# EAGLE design KranPowerV1_3 (EAGLE 6.5.0)
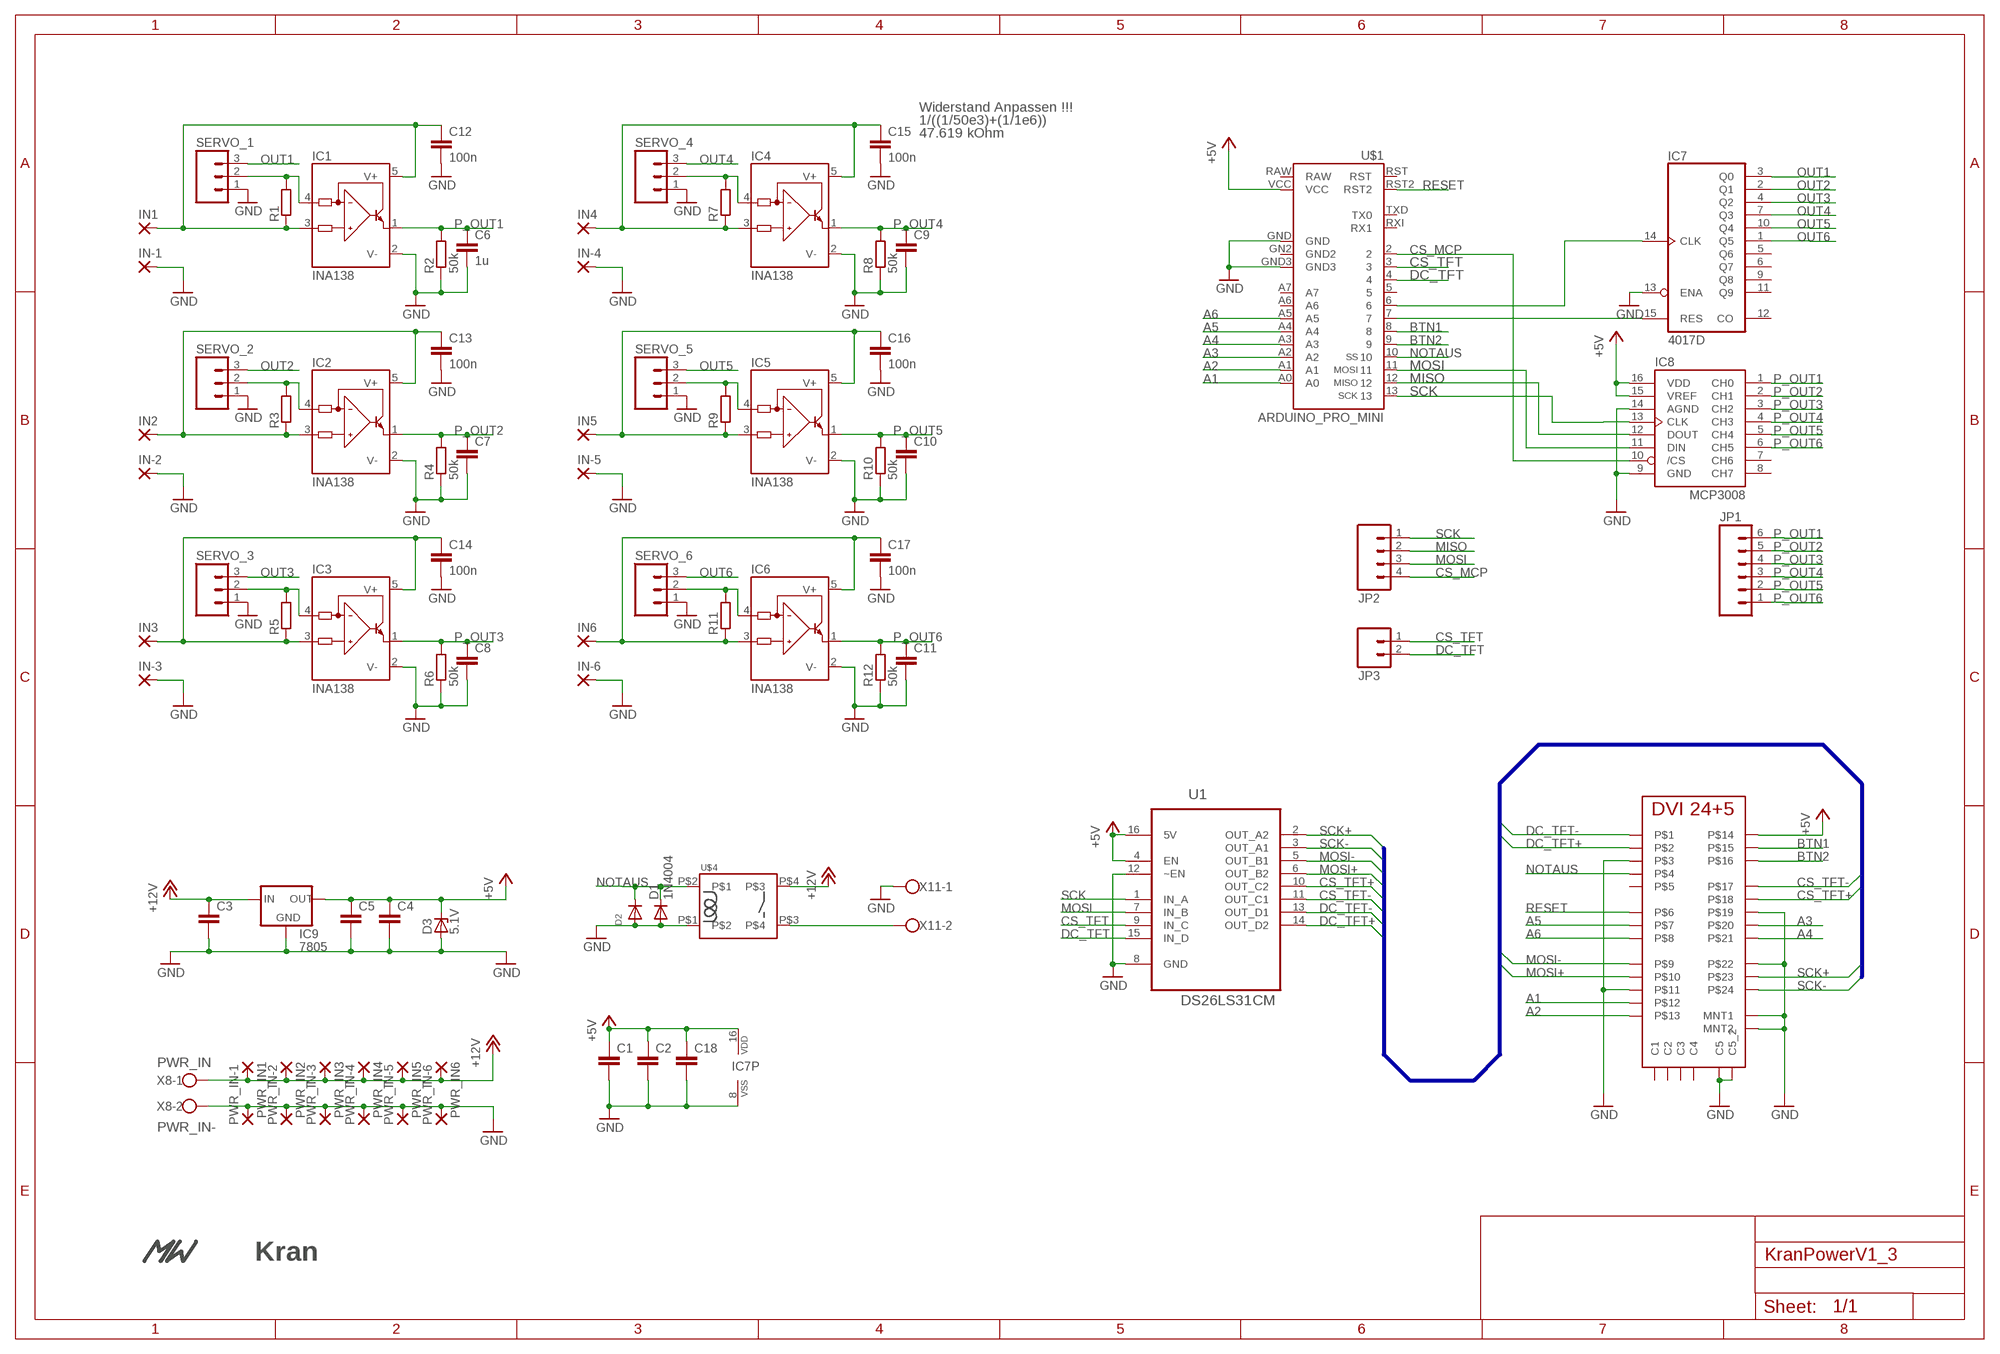
[diagram p0: schematic, sheet 1]

## Parts
C1  C-EUC0603  [C0603]
C2  C-EUC0603  [C0603]
C3  C-EUC0603  [C0603]
C4  C-EUC0603  [C0603]
C5  C-EUC1206  [C1206]
C6  1u  C-EUC0603  [C0603]
C7  C-EUC0603  [C0603]
C8  C-EUC0603  [C0603]
C9  C-EUC0603  [C0603]
C10  C-EUC0603  [C0603]
C11  C-EUC0603  [C0603]
C12  100n  C-EUC0603  [C0603]
C13  100n  C-EUC0603  [C0603]
C14  100n  C-EUC0603  [C0603]
C15  100n  C-EUC0603  [C0603]
C16  100n  C-EUC0603  [C0603]
C17  100n  C-EUC0603  [C0603]
C18  C-EUC0603  [C0603]
D1  1N4004  [DO41-10]
D2  DIODESMA  [SMADIODE]
D3  5.1V  ZENER-DIODEDO34-7  [DO34Z7]
IC1  INA138  [SOT23-5]
IC2  INA138  [SOT23-5]
IC3  INA138  [SOT23-5]
IC4  INA138  [SOT23-5]
IC5  INA138  [SOT23-5]
IC6  INA138  [SOT23-5]
IC7  4017D  [SO16]
IC8  MCP3008  [SO16]
IC9  7805  V_REG_78XXSIDE  [78XXL]
IN1  3,81/1,3  [3,81/1,3]
IN2  3,81/1,3  [3,81/1,3]
IN3  3,81/1,3  [3,81/1,3]
IN4  3,81/1,3  [3,81/1,3]
IN5  3,81/1,3  [3,81/1,3]
IN6  3,81/1,3  [3,81/1,3]
IN-1  3,81/1,3  [3,81/1,3]
IN-2  3,81/1,3  [3,81/1,3]
IN-3  3,81/1,3  [3,81/1,3]
IN-4  3,81/1,3  [3,81/1,3]
IN-5  3,81/1,3  [3,81/1,3]
IN-6  3,81/1,3  [3,81/1,3]
JP1  M06LOCK  [1X06_LOCK]
JP2  M04LOCK  [1X04_LOCK]
JP3  M02LOCK  [1X02_LOCK]
PWR_IN1  3,81/1,3  [3,81/1,3]
PWR_IN2  3,81/1,3  [3,81/1,3]
PWR_IN3  3,81/1,3  [3,81/1,3]
PWR_IN4  3,81/1,3  [3,81/1,3]
PWR_IN5  3,81/1,3  [3,81/1,3]
PWR_IN6  3,81/1,3  [3,81/1,3]
PWR_IN-1  3,81/1,3  [3,81/1,3]
PWR_IN-2  3,81/1,3  [3,81/1,3]
PWR_IN-3  3,81/1,3  [3,81/1,3]
PWR_IN-4  3,81/1,3  [3,81/1,3]
PWR_IN-5  3,81/1,3  [3,81/1,3]
PWR_IN-6  3,81/1,3  [3,81/1,3]
R1  R-EU_R2512  [R2512]
R2  50k  R-EU_R0603  [R0603]
R3  R-EU_R2512  [R2512]
R4  50k  R-EU_R0603  [R0603]
R5  R-EU_R2512  [R2512]
R6  50k  R-EU_R0603  [R0603]
R7  R-EU_R2512  [R2512]
R8  50k  R-EU_R0603  [R0603]
R9  R-EU_R2512  [R2512]
R10  50k  R-EU_R0603  [R0603]
R11  R-EU_R2512  [R2512]
R12  50k  R-EU_R0603  [R0603]
SERVO_1  M03LOCK  [1X03_LOCK]
SERVO_2  M03LOCK  [1X03_LOCK]
SERVO_3  M03LOCK  [1X03_LOCK]
SERVO_4  M03LOCK  [1X03_LOCK]
SERVO_5  M03LOCK  [1X03_LOCK]
SERVO_6  M03LOCK  [1X03_LOCK]
U1  DS26LS31CM  [SOIC127P600X175-16N]
U$1  ARDUINO_PRO_MINI  [ARDUINO_PRO_MINI]
U$2  MW_LOGO  [MW_11X5MM]
U$3  KRAN_LOGO  [KRAN_LOGO]
U$4  RELAY_ZETTLER_AZ767  [RELAY_ZETTLER_AZ767]
U$11  DVI_BUCHSE  [DVI_BUCHSE]
X8  W237-102  [W237-102]
X11  W237-102  [W237-102]

## Nets
+5V: C1.1 C2.1 C4.1 C5.1 C18.1 D3.C IC7.16(VDD) IC8.15(VREF) IC8.16(VDD) IC9.OUT U1.4(EN) U1.16(5V) U$1.VCC U$11.P$14
+12V: C3.1 IC9.IN PWR_IN1.1(P) PWR_IN2.1(P) PWR_IN3.1(P) PWR_IN4.1(P) PWR_IN5.1(P) PWR_IN6.1(P) U$4.P$4 X8.1
A1: U$1.A0 U$11.P$12
A2: U$1.A1 U$11.P$13
A3: U$1.A2 U$11.P$4
A4: U$1.A3 U$11.P$5
A5: U$1.A4 U$11.P$23
A6: U$1.A5 U$11.P$24
BTN1: U$1.8 U$11.P$15
BTN2: U$1.9 U$11.P$16
CS_MCP: IC8.10(/CS) JP2.4 U$1.2
CS_TFT: JP3.1 U1.9(IN_C) U$1.3
CS_TFT+: U1.10(OUT_C2) U$11.P$2
CS_TFT-: U1.11(OUT_C1) U$11.P$1
DC_TFT: JP3.2 U1.15(IN_D) U$1.4
DC_TFT+: U1.14(OUT_D2) U$11.P$18
DC_TFT-: U1.13(OUT_D1) U$11.P$17
GND: C1.2 C2.2 C3.2 C4.2 C5.2 C6.2 C7.2 C8.2 C9.2 C10.2 C11.2 C12.2 C13.2 C14.2 C15.2 C16.2 C17.2 C18.2 D1.A D2.A D3.A IC1.2(V-) IC2.2(V-) IC3.2(V-) IC4.2(V-) IC5.2(V-) IC6.2(V-) IC7.8(VSS) IC7.13(ENA) IC8.9(GND) IC8.14(AGND) IC9.GND IN-1.1(P) IN-2.1(P) IN-3.1(P) IN-4.1(P) IN-5.1(P) IN-6.1(P) PWR_IN-1.1(P) PWR_IN-2.1(P) PWR_IN-3.1(P) PWR_IN-4.1(P) PWR_IN-5.1(P) PWR_IN-6.1(P) R2.1 R4.1 R6.1 R8.1 R10.1 R12.1 SERVO_1.1 SERVO_2.1 SERVO_3.1 SERVO_4.1 SERVO_5.1 SERVO_6.1 U1.8(GND) U1.12(~EN) U$1.GND U$1.GND3 U$4.P$1 U$11.MNT1 U$11.MNT2 U$11.P$3 U$11.P$6 U$11.P$11 U$11.P$19 U$11.P$28(C5) U$11.P$30(C5_2) X8.2 X11.1
MISO: IC8.12(DOUT) JP2.2 U$1.12
MOSI: IC8.11(DIN) JP2.3 U1.7(IN_B) U$1.11
MOSI+: U1.6(OUT_B2) U$11.P$10
MOSI-: U1.5(OUT_B1) U$11.P$9
N$1: C12.1 IC1.3(IN+) IC1.5(V+) IN1.1(P) R1.1
N$2: IC1.4(IN-) R1.2 SERVO_1.2
N$3: C13.1 IC2.3(IN+) IC2.5(V+) IN2.1(P) R3.1
N$4: IC2.4(IN-) R3.2 SERVO_2.2
N$5: C14.1 IC3.3(IN+) IC3.5(V+) IN3.1(P) R5.1
N$6: IC3.4(IN-) R5.2 SERVO_3.2
N$7: C15.1 IC4.3(IN+) IC4.5(V+) IN4.1(P) R7.1
N$8: IC4.4(IN-) R7.2 SERVO_4.2
N$9: C16.1 IC5.3(IN+) IC5.5(V+) IN5.1(P) R9.1
N$10: IC5.4(IN-) R9.2 SERVO_5.2
N$11: C17.1 IC6.3(IN+) IC6.5(V+) IN6.1(P) R11.1
N$12: IC6.4(IN-) R11.2 SERVO_6.2
N$14: IC7.14(CLK) U$1.6
N$15: IC7.15(RES) U$1.7
N$29: U$4.P$3 X11.2
NOTAUS: D1.C D2.C U$1.10 U$4.P$2 U$11.P$20
OUT1: IC7.3(Q0) SERVO_1.3
OUT2: IC7.2(Q1) SERVO_2.3
OUT3: IC7.4(Q2) SERVO_3.3
OUT4: IC7.7(Q3) SERVO_4.3
OUT5: IC7.10(Q4) SERVO_5.3
OUT6: IC7.1(Q5) SERVO_6.3
P_OUT1: C6.1 IC1.1(OUT) IC8.1(CH0) JP1.6 R2.2
P_OUT2: C7.1 IC2.1(OUT) IC8.2(CH1) JP1.5 R4.2
P_OUT3: C8.1 IC3.1(OUT) IC8.3(CH2) JP1.4 R6.2
P_OUT4: C9.1 IC4.1(OUT) IC8.4(CH3) JP1.3 R8.2
P_OUT5: C10.1 IC5.1(OUT) IC8.5(CH4) JP1.2 R10.2
P_OUT6: C11.1 IC6.1(OUT) IC8.6(CH5) JP1.1 R12.2
RESET: U$1.RST2 U$11.P$22
SCK: IC8.13(CLK) JP2.1 U1.1(IN_A) U$1.13
SCK+: U1.2(OUT_A2) U$11.P$7
SCK-: U1.3(OUT_A1) U$11.P$8
Unconnected: IC7.5(Q6) IC7.6(Q7) IC7.9(Q8) IC7.11(Q9) IC7.12(CO) IC8.7(CH6) IC8.8(CH7) U$1.5 U$1.A6 U$1.A7 U$1.GN2(GND2) U$1.RAW U$1.RST U$1.RXI(RX1) U$1.TXD(TX0) U$11.P$21 U$11.P$25(C2) U$11.P$26(C4) U$11.P$27(C3) U$11.P$29(C1)

## Buses
MISO+,MISO-,DC_TFT+,DC_TFT-,MOSI+,MOSI-,CS_TFT+,CS_TFT-,SCK+,SCK-

## Notes on the sheet
- Widerstand Anpassen !!!
- 1/((1/50e3)+(1/1e6))
- 47.619 kOhm
- PWR_IN
- PWR_IN-
- /Users/MatthiasMac/Downloads/kran.bmp

## Library data of the parts
C1-C18 = rcl:C-EU: CAPACITOR, European symbol
D1 = diode:1N4004: DIODE general purpose rectifier, 1 A
D2 = adafruit:DIODE: Diode SMADIODE - SMA Surface Mount Package 20V 1A Schottky Diode Digikey: 641-1014-6-ND DO-1N4148 - Through Hole Small Current Diode SOD-123 20V 1 A (.5mV Vf) Schottky Diode - Digikey: MBRX120TPMSCT-ND SOD-323 10V 570mA (.38mV Vf, 3ns) Schottky Diode - Digikey: ZLLS410CT-ND SOD-523 30V 30mA Schottky Diode (RB751S-40TE61) - Digikey: RB751S-40TE61CT-ND SOT23-R/W - SOT23 Package (R = Solder Paste/Reflow Ovens, W = Hand-Soldering) BAT54Film 40V 300mA - Digikey: 497-7162-1-ND
D3 = diode:ZENER-DIODE: Z-Diode
IC1-IC6 = burr-brown:INA138: High-Side Measurement Current Shunt Monitor; MF: TEXAS INSTRUMENTS; MPN: INA138NA/250; OC_FARNELL: 1564888; OC_NEWARK: 80K5906
IC7 = 40xx:4017: COUNTER/DIVIDER
IC8 = adafruit:MCP3008
IC9 = SparkFun:V_REG_78XX: Voltage Regulator Standard 7805 5V regulator. IGO (Input Ground Output). Spark Fun Electronics SKU : COM-00107
IN1-IN6 IN-1-IN-6 PWR_IN1-PWR_IN6 PWR_IN-1-PWR_IN-6 = wirepad:3,81/1,3: THROUGH-HOLE PAD
JP1 = SparkFun:M06: Header 6 Standard 6-pin 0.1" header. Use with straight break away headers (SKU : PRT-00116), right angle break away headers (PRT-00553), swiss pins (PRT-00743), machine pins (PRT-00117), and female headers (PRT-00115). Molex polarized connector foot print use with SKU : PRT-08094 with associated crimp pins and housings. NOTES ON THE VARIANTS LOCK and LOCK_LONGPADS... This footprint was designed to help hold the alignment of a through-hole component (i.e. 6-pin header) while soldering it into place. You may notice that each hole has been shifted either up or down by 0.005 of an inch from it's more standard position (which is a perfectly straight line). This slight alteration caused the pins (the squares in the middle) to touch the edges of the holes. Because they are alternating, it causes a "brace" to hold the component in place. 0.005 has proven to be the perfect amount of "off-center" position when using our standard breakaway headers. Although looks a little odd when you look at the bare footprint, once you have a header in there, the alteration is very hard to notice. Also, if you push a header all the way into place, it is covered up entirely on the bottom side. This idea of altering the position of holes to aid alignment will be further integrated into the Sparkfun Library for other footprints. It can help hold any component with 3 or more connection pins.
JP2 = SparkFun:M04: Header 4 Standard 4-pin 0.1" header. Use with straight break away headers (SKU : PRT-00116), right angle break away headers (PRT-00553), swiss pins (PRT-00743), machine pins (PRT-00117), and female headers (PRT-00115). Molex polarized connector foot print use with SKU : PRT-08231 with associated crimp pins and housings. 1MM SMD Version SKU: PRT-10208
JP3 = SparkFun:M02: Header 2 Standard 2-pin 0.1" header. Use with straight break away headers (SKU : PRT-00116), right angle break away headers (PRT-00553), swiss pins (PRT-00743), machine pins (PRT-00117), and female headers (PRT-00115). Molex polarized connector foot print use with SKU : PRT-08233 with associated crimp pins and housings.
R1-R12 = rcl:R-EU_: RESISTOR, European symbol
SERVO_1-SERVO_6 = SparkFun:M03: Header 3 Standard 3-pin 0.1" header. Use with straight break away headers (SKU : PRT-00116), right angle break away headers (PRT-00553), swiss pins (PRT-00743), machine pins (PRT-00117), and female headers (PRT-00115). Molex polarized connector foot print use with SKU : PRT-08232 with associated crimp pins and housings.
U1 = Matthias:DS26LS31CM: Line Driver; MPN: DS26LS31CM; OC_FARNELL: 9487859; OC_NEWARK: 07B5236; PACKAGE: SOIC-16; SUPPLIER: NationalSemiconductor
U$1 = SparkFun:ARDUINO_PRO_MINI
U$2 = MWlogo:MW_LOGO
U$3 = MWlogo:KRAN_LOGO
U$4 = SparkFun:RELAY_ZETTLER_AZ767: http://www.conrad.de/ce/de/product/503633/Subminiatur-Leistungs-Relais-AZ767-10-A-Zettler-Electronics-AZ767-1A-6DE-6-VDC-1-Schliesser-Max-DC-5-AAC-10-A-Max?queryFromSuggest=true
U$11 = Matthias:DVI_BUCHSE
X8 X11 = con-wago-500:W237-102: WAGO SCREW CLAMP; MPN: 237-102; OC_FARNELL: unknown; OC_NEWARK: 70K9898

## Board
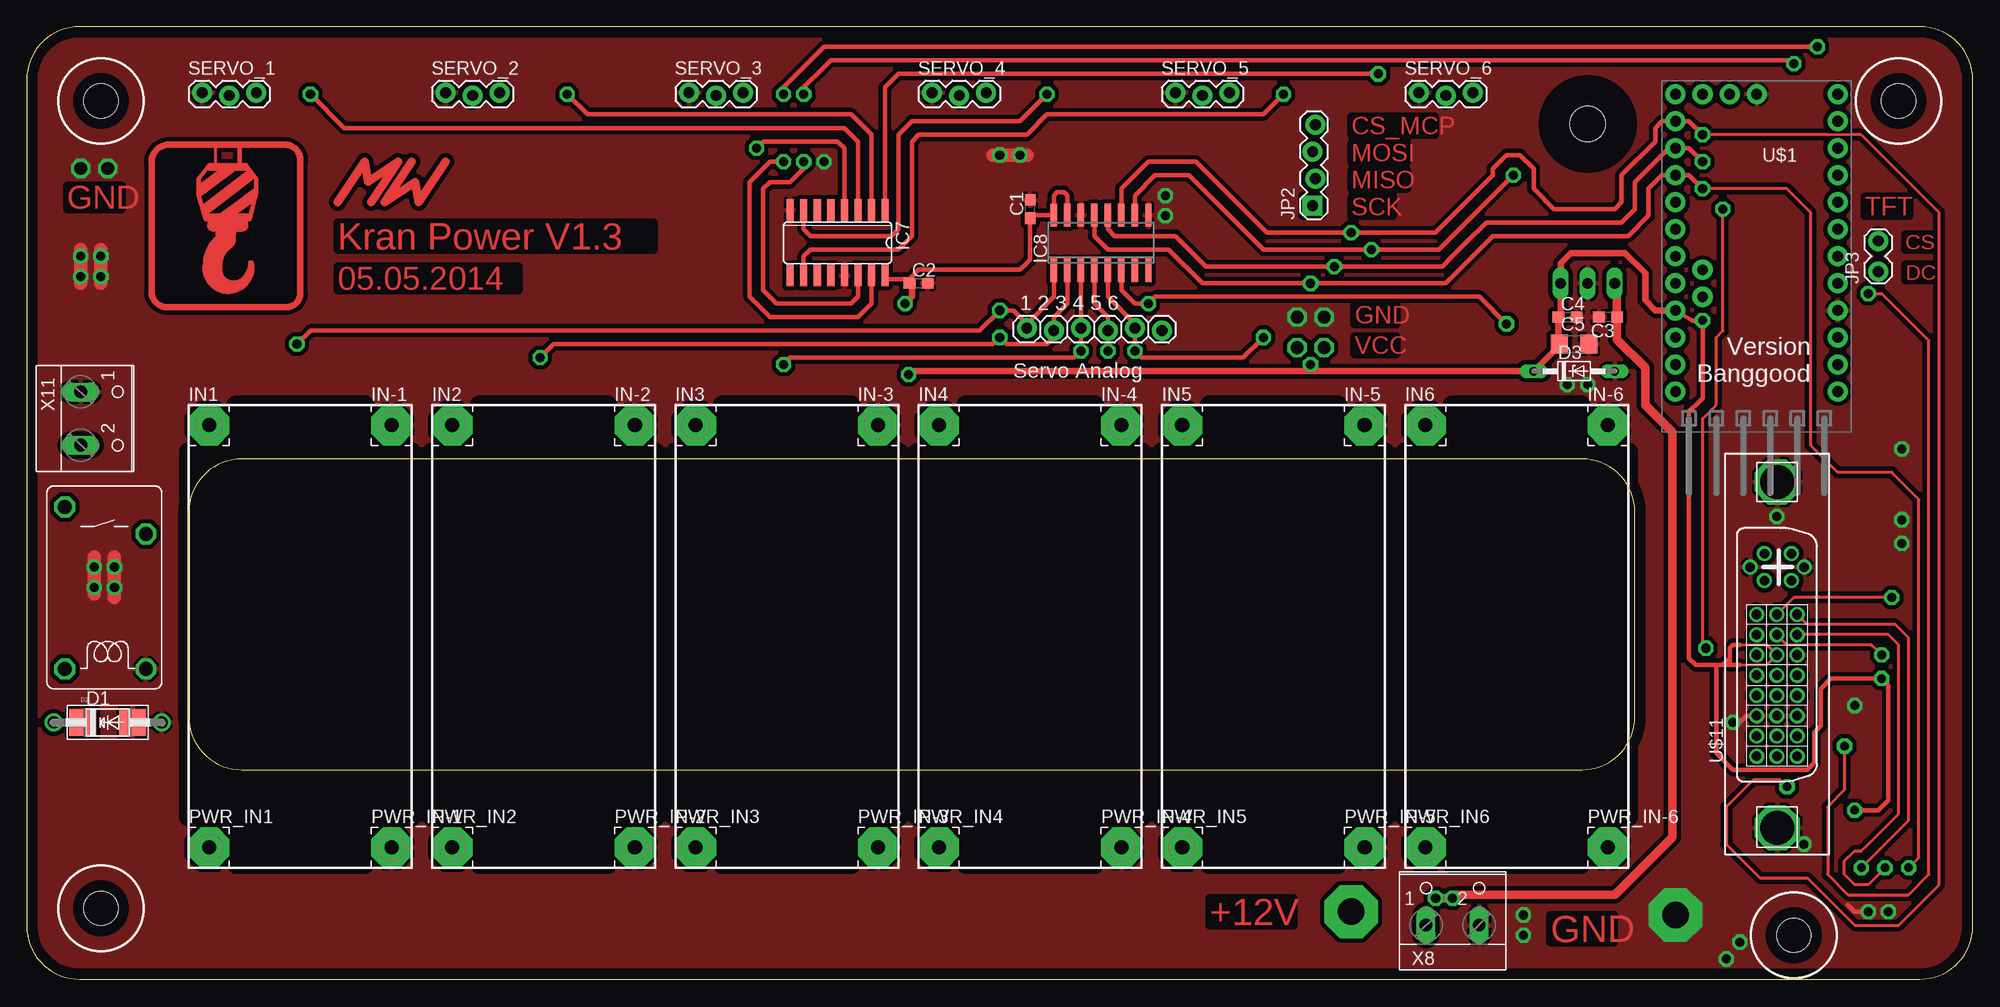
[diagram p1: board, top side]
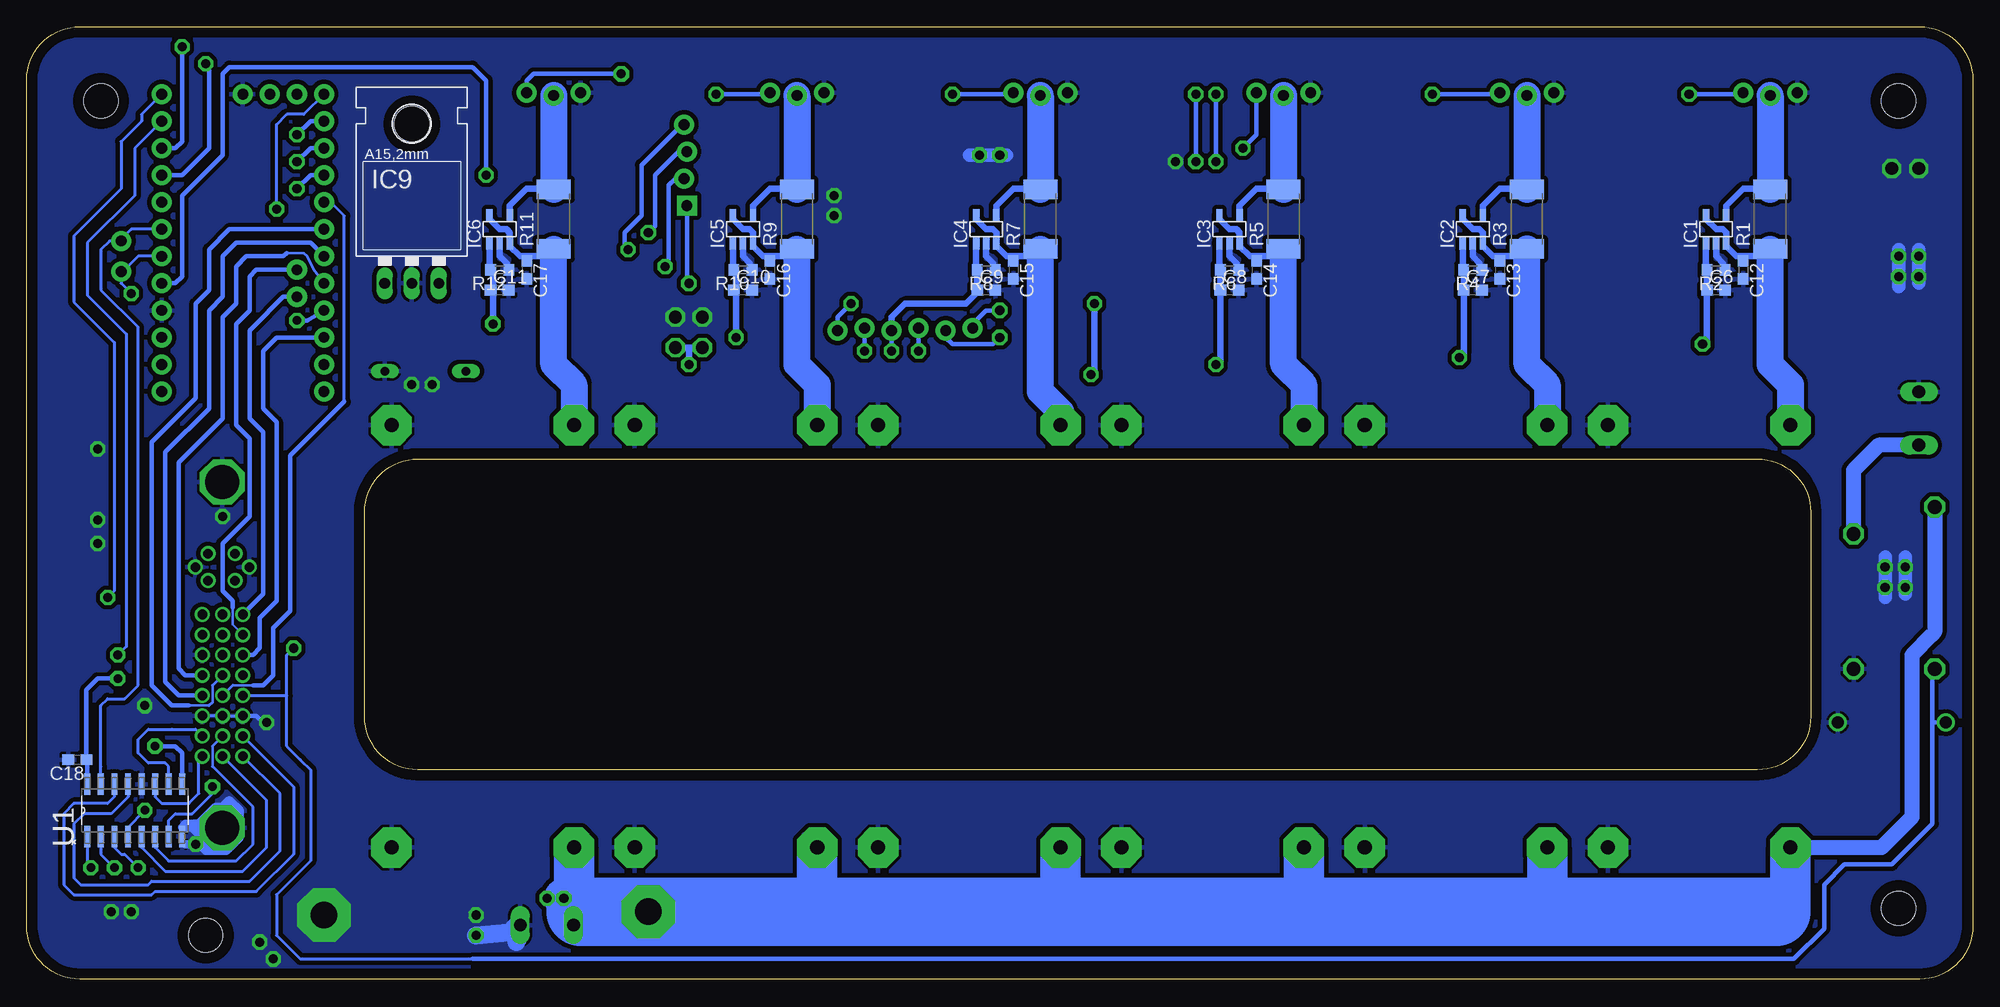
[diagram p2: board, bottom side, seen from below]

Size 182.88 x 89.53 mm. Coordinates in mm from the lower left corner, seen from the top.
Outline: 0,84.53 0,5 arc90 5,0 177.88,0 arc90 182.88,5 182.88,84.53 arc90 177.88,89.53 5,89.53 arc90 0,84.53
Outline: 15.24,43.89 15.24,24.68 arc90 20.24,19.68 146.13,19.68 arc90 151.13,24.68 151.13,43.89 arc90 146.13,48.89 20.24,48.89 arc90 15.24,43.89
Copper layers (1*16): Top 0.035mm / dielectric 1.5mm / Bottom 0.035mm
Design rules "default": minimum track width 10mil, minimum drill 24mil, track to track 8mil, track to pad 8mil, pad to pad 8mil, via to via 8mil, smd to smd 8mil, copper to edge 40mil, drill to drill 8mil, minimum pad ring 10mil, minimum via ring 8mil, stop-mask expansion 4mil, vias tented up to drill 0mil, thermal gap 10mil
Holes 3.2 mm at 6.98,6.67 6.98,82.55 175.9,82.55 166.05,4.13
tRestrict: area 15.2,10.8 to 36.2,54; area 38.1,10.8 to 59.1,54; area 61,10.8 to 81.9,54; area 83.8,10.8 to 104.8,54; area 106.7,10.8 to 127.6,54; area 129.5,10.8 to 150.5,54
bRestrict: area 15.2,19.7 to 151.1,48.9

### Footprints (pad centres in the part's own frame; a part is rotated, then mirrored left to right if it is on the bottom)
C0603 = smd 1.1 x 1: 1 -0.85,0; 2 0.85,0
C1206 = smd 1.6 x 1.8: 1 -1.4,0; 2 1.4,0
DO41-10 = drill 1.118: A 5.08,0; C -5.08,0
SMADIODE = smd 2.54 x 2.54: A 2.349,0; C -2.349,0
DO34Z7 = drill 0.813 long: A 3.81,0; C -3.81,0
SOT23-5 = smd 0.6 x 1.2: 1 -0.95,-1.306; 2 0,-1.306; 3 0.95,-1.306; 4 0.95,1.306; 5 -0.95,1.306
SO16 = smd 0.66 x 2.032: 1 -4.445,-3.073; 2 -3.175,-3.073; 3 -1.905,-3.073; 4 -0.635,-3.073; 5 0.635,-3.073; 6 1.905,-3.073; 7 3.175,-3.073; 8 4.445,-3.073; 9 4.445,3.073; 10 3.175,3.073; 11 1.905,3.073; 12 0.635,3.073; 13 -0.635,3.073; 14 -1.905,3.073; 15 -3.175,3.073; 16 -4.445,3.073
SO16' = smd 0.6 x 2.2: 1 -4.445,-2.6; 2 -3.175,-2.6; 3 -1.905,-2.6; 4 -0.635,-2.6; 5 0.635,-2.6; 6 1.905,-2.6; 7 3.175,-2.6; 8 4.445,-2.6; 9 4.445,2.6; 10 3.175,2.6; 11 1.905,2.6; 12 0.635,2.6; 13 -0.635,2.6; 14 -1.905,2.6; 15 -3.175,2.6; 16 -4.445,2.6
78XXL = drill 1.016 long: GND 0,-3.81; IN -2.54,-3.81; OUT 2.54,-3.81 | hole 3.302: 0,11.176
3,81/1,3 = drill 1.321 pad 3.81 octagon: 1 0,0
1X06_LOCK = drill 1.016 pad 1.88: 1 0,0; 2 2.54,-0.254; 3 5.08,0; 4 7.62,-0.254; 5 10.16,0; 6 12.7,-0.254
1X04_LOCK = drill 1.016 pad 1.88 square: 1 0,0.127 | drill 1.016 pad 1.88: 2 2.54,-0.127; 3 5.08,0.127; 4 7.62,-0.127
1X02_LOCK = drill 1.016 pad 1.88: 1 -0.178,0; 2 2.718,0
R2512 = smd 1.8 x 3.2: 1 -2.8,0; 2 2.8,0
R0603 = smd 1 x 1.1: 1 -0.85,0; 2 0.85,0
1X03_LOCK = drill 1.016 pad 1.88: 1 0,0.127; 2 2.54,-0.127; 3 5.08,0.127
SOIC127P600X175-16N = smd 1.981 x 0.559: 1 -2.464,4.445; 2 -2.464,3.175; 3 -2.464,1.905; 4 -2.464,0.635; 5 -2.464,-0.635; 6 -2.464,-1.905; 7 -2.464,-3.175; 8 -2.464,-4.445; 9 2.464,-4.445; 10 2.464,-3.175; 11 2.464,-1.905; 12 2.464,-0.635; 13 2.464,0.635; 14 2.464,1.905; 15 2.464,3.175; 16 2.464,4.445
ARDUINO_PRO_MINI = drill 1.016 pad 1.88: 2 -7.62,2.54; 3 -7.62,0; 4 -7.62,-2.54; 5 -7.62,-5.08; 6 -7.62,-7.62; 7 -7.62,-10.16; 8 -7.62,-12.7; 9 -7.62,-15.24; 10 7.62,-15.24; 11 7.62,-12.7; 12 7.62,-10.16; 13 7.62,-7.62; A0 7.62,-5.08; A1 7.62,-2.54; A2 7.62,0; A3 7.62,2.54; A4 5.08,1.27; A5 5.08,3.81; A6 2.54,-15.24; A7 5.08,-15.24; GN2 7.62,10.16; GND -7.62,5.08; GND3 0,-15.24; RAW 7.62,12.7; RST -7.62,7.62; RST2 7.62,7.62; RXI -7.62,10.16; TXD -7.62,12.7; VCC 7.62,5.08
RELAY_ZETTLER_AZ767 = drill 1.3 octagon: P$1 1.85,1.49; P$2 1.85,9.11; P$3 14.55,1.49; P$4 17.09,9.11
DVI_BUCHSE = drill 3.2 octagon: MNT1 -6.71,1.878; MNT2 25.79,1.878 | drill 0.9: P$1 -0.003,-0.006; P$2 1.902,-0.006; P$3 3.807,-0.006; P$4 5.712,-0.006; P$5 7.617,-0.006; P$6 9.522,-0.006; P$7 11.427,-0.006; P$8 13.332,-0.006; P$9 -0.003,1.899; P$10 1.902,1.899; P$11 3.807,1.899; P$12 5.712,1.899; P$13 7.617,1.899; P$14 9.522,1.899; P$15 11.427,1.899; P$16 13.332,1.899; P$17 -0.003,3.804; P$18 1.902,3.804; P$19 3.807,3.804; P$20 5.712,3.804; P$21 7.617,3.804; P$22 9.522,3.804; P$23 11.427,3.804; P$24 13.332,3.804; P$25 19.047,3.07; P$26 19.047,0.53; P$27 16.507,0.53; P$28 17.777,-0.661; P$29 16.507,3.07; P$30 17.777,4.42
W237-102 = drill 1.194 long: 1 -2.5,-1.27; 2 2.5,-1.27

### Placement (x,y rotation side)
C1  94.3,72.39 90 top
C2  83.82,65.41 0 top
C3  148.59,62.23 180 top
C4  144.78,62.23 0 top
C5  145.42,59.69 0 top
C6  24.13,64.77 0 bottom
C7  46.99,64.77 0 bottom
C8  69.85,64.77 0 bottom
C9  92.71,64.77 0 bottom
C10  115.57,64.77 0 bottom
C11  138.43,64.77 0 bottom
C12  21.59,66.67 270 bottom
C13  44.45,66.67 270 bottom
C14  67.31,66.67 270 bottom
C15  90.17,66.67 270 bottom
C16  113.03,66.67 270 bottom
C17  135.89,66.67 270 bottom
C18  178.12,20.64 180 bottom
D1  7.62,24.13 0 top
D2  7.62,24.13 0 top
D3  145.42,57.15 0 top
IC1  24.13,70.48 0 bottom
IC2  46.99,70.48 0 bottom
IC3  69.85,70.48 0 bottom
IC4  92.71,70.48 0 bottom
IC5  115.57,70.48 0 bottom
IC6  138.43,70.48 0 bottom
IC7  76.2,69.22 180 top
IC8  MCP3008  [SO16']  100.96,69.22 0 top
IC9  146.69,69.22 0 bottom
IN1  17.14,52.07 0 top
IN2  40.01,52.07 0 top
IN3  62.87,52.07 0 top
IN4  85.72,52.07 0 top
IN5  108.58,52.07 0 top
IN6  131.44,52.07 0 top
IN-1  34.29,52.07 0 top
IN-2  57.15,52.07 0 top
IN-3  80.01,52.07 0 top
IN-4  102.87,52.07 0 top
IN-5  125.73,52.07 0 top
IN-6  148.59,52.07 0 top
JP1  106.68,60.96 180 top
JP2  120.97,72.71 90 top
JP3  173.99,66.67 90 top
PWR_IN1  17.14,12.38 0 top
PWR_IN2  40.01,12.38 0 top
PWR_IN3  62.87,12.38 0 top
PWR_IN4  85.72,12.38 0 top
PWR_IN5  108.58,12.38 0 top
PWR_IN6  131.44,12.38 0 top
PWR_IN-1  34.29,12.38 0 top
PWR_IN-2  57.15,12.38 0 top
PWR_IN-3  80.01,12.38 0 top
PWR_IN-4  102.87,12.38 0 top
PWR_IN-5  125.73,12.38 0 top
PWR_IN-6  148.59,12.38 0 top
R1  19.05,71.44 90 bottom
R2  24.13,66.67 180 bottom
R3  41.91,71.44 90 bottom
R4  46.99,66.67 180 bottom
R5  64.77,71.44 90 bottom
R6  69.85,66.67 180 bottom
R7  87.63,71.44 90 bottom
R8  92.71,66.67 180 bottom
R9  110.49,71.44 90 bottom
R10  115.57,66.67 180 bottom
R11  133.35,71.44 90 bottom
R12  138.43,66.67 180 bottom
SERVO_1  16.51,83.19 0 top
SERVO_2  39.37,83.19 0 top
SERVO_3  62.23,83.19 0 top
SERVO_4  85.09,83.19 0 top
SERVO_5  107.95,83.19 0 top
SERVO_6  130.81,83.19 0 top
U1  172.72,15.88 90 bottom
U$1  162.56,67.94 180 top
U$2  29.21,73.03 0 top
U$3  11.43,62.86 0 top
U$4  12.7,27.3 90 top
U$11  166.37,20.95 90 top
X8  133.99,6.35 0 top
X11  6.35,52.7 270 top

### Tracks (layer width: path | path; a pad name or v marks a point on that pad's centre or on a via)
+5V  (via drill 0.8 pad 1.42, 0.85 pad 1.42, 1.2)
  Top 0.254: 163.51,31.43 160.97,31.43 | 160.97,29.53 163.51,29.53
  Top 0.305: U$11.P$14 | U$11.P$14 163.83,31.11 | 163.83,31.11 163.51,31.43 | 163.51,29.53 U$11.P$14 | U$11.P$14 163.83,31.11
  Top 0.406: C2.1 82.97,65.83 | 82.97,65.83 83.82,66.67 93.34,66.67 93.98,67.31 94.19,67.53 94.3,67.63 C1.1 94.57,71.81 IC8.16 96.52,73.66 96.84,73.98 97.47,73.98 97.79,73.66 97.79,72.07 IC8.15 | 82.97,65.83 80.96,65.83 IC7.16 | 82.55,57.15 83.18,57.15 82.87,57.15 v82.87,56.83 | 160.97,29.53 160.34,29.53 160.02,29.53 | 160.02,29.53 159.39,29.53 | 159.39,29.53 158.75,29.53 | 156.53,61.91 U$1.VCC 156.53,61.91 | 156.53,61.91 v157.48,61.91 157.48,54.61 | v171.77,15.88 173.99,15.88 174.94,16.83 174.94,27.62 v174.31,28.26 169.55,28.26 168.59,27.3 168.59,23.81 167.96,23.18 167.96,20.32 167.32,19.68 160.34,19.68 158.75,21.27 158.75,29.21 158.75,29.53 | 157.16,54.29 156.21,53.34 156.21,30.16 156.84,29.53 158.75,29.53 | 157.16,54.29 157.48,54.61 | 157.48,54.61 157.16,54.29 | 160.97,31.43 160.34,31.43 160.02,31.11 160.02,30.16 | 160.02,30.16 159.39,29.53 | 159.39,29.53 160.02,30.16 | 160.02,30.16 160.02,29.53
  Top 0.61: v82.55,63.5 83.18,64.14 83.18,65.19 C2.1 | 83.18,57.15 120.65,57.15 | 120.65,57.15 D3.C 143.51,59.05 144.02,59.56 C5.1 143.93,59.77 C4.1 144.15,62.23 IC9.OUT 144.15,67.31 145.1,68.26 150.18,68.26 152.08,66.36 152.08,63.82 153.03,62.86 U$1.VCC | v120.65,57.78 120.65,57.15
  Bottom 0.305: U1.4 173.36,14.29 v171.77,15.88
  Bottom 0.406: U1.16 177.17,20.54 C18.1 177.27,27.2 176.21,28.26 v174.31,28.26 | v157.48,61.91 156.53,61.91 U$1.VCC
  Bottom 0.61: v82.87,56.83 82.55,57.15 82.55,59.05 v82.55,63.5 | 120.65,59.37 v121.92,59.37 120.65,59.37 | 120.65,59.37 v119.38,59.37 | 120.65,59.37 v120.65,57.78
+12V  (via drill 0.85 pad 1.42, 2.5 pad 5)
  Top 0.813: IC9.IN 149.44,65.19 C3.1 149.44,60.11 152.08,57.47 152.08,53.98 154.62,51.44 154.62,13.34 150.18,8.89 149.23,7.94 134.3,7.94 v133.99,7.62 v132.4,7.62
  Bottom 0.406: 131.44,6.35 131.49,6.35 X8.1
  Bottom 0.813: v132.4,7.62 v133.99,7.62
  Bottom 1.422: PWR_IN1.1 8.57,12.38 5.71,15.24 5.71,30.48 3.81,32.38 3.59,32.61 U$4.P$4
  Bottom 3.81: v132.4,7.62 132.08,7.58 131.49,6.98 131.49,7.58 129.54,6.35 129.54,5.71 | PWR_IN6.1 131.44,6.35 130.81,6.35 | PWR_IN5.1 108.58,6.35 | PWR_IN4.1 85.72,6.35 86.36,6.35 | PWR_IN3.1 62.87,6.35 62.23,6.35 | PWR_IN2.1 40.01,6.35 40.64,6.35 | 18.45,6.35 17.14,6.39 PWR_IN1.1
  Bottom 6.452: 129.54,6.35 130.81,6.35 | 130.81,6.35 130.18,6.35 129.54,6.35 | 129.54,6.35 130.81,6.35 | 130.81,6.35 129.54,6.35 | 129.54,6.35 v124.46,6.35 108.58,6.35 86.36,6.35 62.23,6.35 40.64,6.35 18.45,6.35
A1
  Bottom 0.254: 163.51,27.62 161.61,27.62
  Bottom 0.305: U$11.P$12 163.51,27.62 | 153.03,54.29 153.03,71.75 154.31,73.03 U$1.A0
  Bottom 0.406: 153.03,54.29 154.31,53.02 158.12,49.21 158.12,34.61 159.7,33.02 159.7,28.57 160.66,27.62 161.61,27.62
A2
  Bottom 0.254: 165.42,27.62 165.42,26.04 | 165.74,25.72 167.32,25.72 167.64,25.72
  Bottom 0.305: 165.74,25.72 165.42,26.04 | 165.42,27.62 U$11.P$13
  Bottom 0.406: U$1.A1 163.83,70.48 165.74,68.58 165.74,64.77 167,63.5 167,54.61 171.13,50.48 171.13,27.62 169.23,25.72 167.64,25.72
A3
  Bottom 0.406: 165.74,54.61 165.74,53.66 | 165.74,53.66 165.74,53.98 | 165.74,53.98 165.74,53.66 | 165.74,53.66 165.74,53.98 | 165.74,53.98 165.74,54.61 | 165.74,54.61 165.74,62.86 164.47,64.14 164.47,67.94 163.2,69.22 156.21,69.22 U$1.A2 | 165.74,53.66 169.86,49.53 169.86,27.94 168.59,26.67 U$11.P$4
A4
  Bottom 0.254: U$1.A3 155.89,66.67 156.53,67.94 156.84,68.26 157.16,68.26 158.43,68.26
  Bottom 0.406: U$11.P$5 167.96,28.57 168.59,29.21 168.59,48.58 164.47,52.7 164.47,62.23 163.2,63.5 163.2,66.99 162.24,67.94 158.75,67.94 158.43,68.26
A5
  Bottom 0.254: 163.51,34.92 163.51,33.33 U$11.P$23
  Bottom 0.406: U$1.A4 157.8,66.67 161.29,66.67 161.93,66.04 161.93,62.86 163.2,61.59 163.2,52.07 161.93,50.8 161.93,43.5 164.47,40.96 164.47,36.51 163.51,35.56 163.51,34.92
A6
  Bottom 0.406: U$1.A5 158.75,64.14 161.61,61.28 161.93,60.96 161.93,52.7 160.66,51.44 160.66,36.2 U$11.P$24
BTN1  (via drill 0.85 pad 1.42)
  Top 0.254: 167.32,31.43 165.42,31.43
  Top 0.305: v174.31,30.48 173.67,31.11 173.36,31.43 167.32,31.43 | 165.42,31.43 165.42,31.44 U$11.P$15
  Bottom 0.305: U$1.8 172.72,78.11 172.72,73.66 177.17,69.22 177.17,64.29 173.51,60.64 173.51,31.27 v174.31,30.48
BTN2  (via drill 0.85 pad 1.42)
  Top 0.305: v175.26,35.88 166.05,35.88 U$11.P$16
  Bottom 0.305: U$1.9 172.09,81.28 172.09,80.64 173.99,78.74 173.99,74.3 178.44,69.85 178.44,63.66 174.62,59.85 174.62,36.51 v175.26,35.88
CS_MCP  (via drill 0.85 pad 1.42)
  Top 0.406: v139.7,75.56 132.72,68.58 127,68.58 | IC8.10 104.14,73.66 106.05,75.56 109.22,75.56 113.66,71.12 116.2,68.58 v126.36,68.58 | IC8.10 104.14,71.75 IC8.10 | 127,68.58 v126.36,68.58 | v126.36,68.58 127,68.58
  Bottom 0.406: U$1.2 168.91,65.41 168.28,66.04 168.28,73.66 164.47,77.47 164.47,85.09 163.83,85.72 140.97,85.72 139.7,84.45 139.7,79.38 v139.7,75.56 | JP2.4 121.28,80.33 125.09,76.52 125.09,71.75 126.68,70.17 126.68,68.58 v126.36,68.58
CS_TFT  (via drill 0.8 pad 1.42, 0.85 pad 1.42)
  Top 0.305: v170.81,21.91 170.81,17.78 169.23,16.19 169.23,9.84 171.13,7.94 176.85,7.94 178.75,9.84 178.75,60.01 174.31,64.45 v173.04,64.45
  Bottom 0.305: U$1.3 172.4,67.94 173.99,66.36 | 173.99,66.36 JP3.1 | 173.99,66.36 173.99,65.41 v173.04,64.45
  Bottom 0.406: U1.9 168.28,21.27 168.91,21.91 v170.81,21.91
CS_TFT+
  Bottom 0.305: U$11.P$2 167.01,23.49 169.23,23.49 171.45,23.49 172.4,22.54 172.4,21.27 171.45,20.32 169.86,20.32 169.55,20 U1.10
CS_TFT-
  Bottom 0.305: U1.11 170.81,17.14 170.18,16.51 167.64,16.51 166.69,17.46 166.69,20.63 U$11.P$1
DC_TFT
  Bottom 0.305: U1.15 175.9,20 175.9,25.72 175.26,26.35 173.67,26.35 173.36,26.67 172.4,27.62 172.4,61.28 175.9,64.77 175.9,68.58 175.08,69.39 JP3.2 173.99,69.53 173.04,70.48 U$1.4
DC_TFT+
  Bottom 0.305: U1.14 174.62,17.14 175.26,16.51 178.44,16.51 179.39,15.56 179.39,8.89 178.44,7.94 171.13,7.94 170.81,8.26 161.29,8.26 157.8,11.75 157.8,18.1 162.56,22.86 U$11.P$18
DC_TFT-
  Bottom 0.305: U1.13 173.36,17.14 174.94,15.56 177.48,15.56 178.44,14.6 178.44,9.52 177.8,8.89 171.45,8.89 171.13,9.21 161.93,9.21 159.07,12.06 159.07,17.45 U$11.P$17
GND  (via drill 0.85 pad 1.42, 1.2, 2.5 pad 5)
  Top 0.406: v160.34,24.13 160.97,24.13 161.61,24.77 U$11.P$19 | 172.72,6.35 171.77,6.35 171.13,6.98
  Top 1.27: v6.98,66.04 6.98,68.58 6.98,65.41 | v5.08,66.04 5.08,65.41 v5.08,66.04 | v5.08,66.04 5.08,68.58 | v8.25,36.83 8.25,39.69 8.25,35.88 | v6.35,36.83 6.35,36.2 v6.35,36.83 | v6.35,36.83 6.35,39.69 | v93.34,77.47 90.8,77.47 93.98,77.47
  Bottom 0.305: 161.29,24.77 161.29,24.76 U$11.P$19 U$11.P$11 U$11.P$3
  Bottom 0.406: U1.8 168.28,13.02 167.96,12.7 | v160.34,24.13 160.66,24.13 161.29,24.77 U$11.P$19
  Bottom 0.61: IC1.2 24.13,67.94 23.5,67.31 23.5,66.89 R2.1 | IC2.2 46.99,67.94 46.35,67.31 46.35,66.89 R4.1 | IC3.2 69.85,67.94 69.22,67.31 69.22,66.89 R6.1 | IC4.2 92.71,67.94 92.07,67.31 92.07,66.89 R8.1 | IC5.2 115.57,67.94 114.93,67.31 114.93,66.89 R10.1 | IC6.2 138.43,67.94 137.8,67.31 137.8,66.89 R12.1
  Bottom 0.813: 167.96,12.7 v167,12.7 | v167,12.7 166.69,12.7 166.05,12.06 164.15,12.06 162.88,13.34 162.88,15.88 163.83,16.83 164.15,16.51 164.47,16.19 165.1,16.19 166.69,14.6 167.96,14.6 168.28,14.29 167.32,14.29 165.74,12.7 v167,12.7
  Bottom 1.27: v6.98,66.04 6.98,65.09 v6.98,66.04 | v6.98,66.04 6.98,68.58 | v5.08,66.04 5.08,65.41 5.08,68.58 | v8.25,36.83 8.25,35.88 v8.25,36.83 | v8.25,36.83 8.25,39.69 | v6.35,36.83 6.35,36.2 6.35,39.69 | v93.34,77.47 94.3,77.47 v93.34,77.47 | v93.34,77.47 90.8,77.47
  Bottom 1.676: v140.65,4.13 137.16,4.45 137.16,4.76 136.53,5.4 136.84,3.49
  other vias: 107,71.75 107,73.66 74.93,76.84 144.78,55.88 146.69,55.88 5.08,76.2 7.62,76.2 121.92,62.23 119.38,62.23 140.65,6.03 5.08,67.94 6.98,67.94 154.94,6.03 164.47,43.5 176.21,43.18 171.77,25.72 176.21,49.85 159.7,1.91 160.97,3.49 174.94,6.35 176.21,40.96 6.35,38.73 8.25,38.73 91.44,77.47 173.04,6.35
  pour Bottom (isolate 0.406): 0,84.53 0,5 arc90 5,0 177.88,0 arc90 182.88,5 182.88,84.53 arc90 177.88,89.53 5,89.53 arc90
  pour Top (isolate 0.406): 0,84.53 0,5 arc90 5,0 177.88,0 arc90 182.88,5 182.88,84.53 arc90 177.88,89.53 5,89.53 arc90
MISO  (via drill 0.85 pad 1.42)
  Top 0.406: v122.87,66.99 133.03,66.99 133.99,67.94 135.25,69.22 137.16,71.12 149.86,71.12 151.13,72.39 151.13,74.93 154.31,78.11 156.21,78.11 v157.48,76.84 | v122.87,66.99 122.55,66.99 | 122.55,66.99 110.81,66.99 107.95,69.85 102.23,69.85 101.6,70.48 101.6,71.75 IC8.12 | v122.87,66.99 122.55,66.99
  Bottom 0.406: v157.48,76.84 156.21,78.11 U$1.12 | JP2.2 121.92,75.25 122.55,74.61 122.55,67.31 v122.87,66.99
MOSI  (via drill 0.8 pad 1.42, 0.85 pad 1.42)
  Top 0.254: 171.45,79.38 169.23,79.38
  Top 0.305: v157.48,79.38 163.2,79.38 169.23,79.38 | v165.42,18.1 164.78,18.73 162.24,18.73 159.7,16.19 159.7,12.7 162.88,9.52 167.32,9.52 171.77,5.08 175.9,5.08 179.71,8.89 179.71,72.07 172.4,79.38 171.45,79.38
  Top 0.406: IC8.11 102.87,74.3 105.41,76.84 109.85,76.84 114.93,71.75 116.52,70.17 124.14,70.17 | v157.48,79.38 156.21,80.64 153.67,80.64 153.03,80.01 153.03,78.74 149.86,75.56 149.86,73.03 149.23,72.39 144.15,72.39 143.51,72.39 141.6,74.3 141.6,76.2 140.34,77.47 139.06,77.47 137.8,76.2 137.8,75.56 133.99,71.75 132.4,70.17 v124.46,70.17 | v124.46,70.17 124.14,70.17 | v124.46,70.17 124.14,70.17
  Bottom 0.305: U1.7 169.55,14.92 168.91,15.56 167.32,15.56 165.42,17.46 v165.42,18.1
  Bottom 0.406: v157.48,79.38 156.21,80.64 U$1.11 | JP2.3 121.6,77.79 123.82,75.56 123.82,70.8 v124.46,70.17
MOSI+
  Bottom 0.254: 165.42,21.91 165.42,20
  Bottom 0.305: U1.6 170.81,12.38 169.55,11.11 163.2,11.11 161.61,12.7 161.61,16.19 165.42,20 | 165.42,21.91 U$11.P$10
MOSI-
  Bottom 0.305: U1.5 172.09,12.38 169.86,10.16 162.56,10.16 160.34,12.38 160.34,16.83 U$11.P$9
N$1
  Bottom 0.406: 22.23,67.94 22.01,67.94 C12.1
  Bottom 0.61: IC1.5 25.08,71.44 24.13,70.48 23.5,70.48 23.18,70.17 IC1.3 23.18,68.9 22.23,67.94 19.05,67.94 | R1.1 19.05,68.58
  Bottom 2.54: IN1.1 17.14,55.88 19.05,57.78 19.05,67.94 | 19.05,67.94 19.05,68.58 19.05,67.94
N$2
  Bottom 0.61: IC1.4 23.18,72.7 21.59,74.3 19.05,74.3 R1.2
  Bottom 2.54: SERVO_1.2 19.05,74.3 R1.2
N$3
  Bottom 0.406: C13.1 44.45,67.94
  Bottom 0.61: IC2.5 47.94,71.44 46.99,70.48 46.35,70.48 46.04,70.17 IC2.3 46.04,68.9 45.09,67.94 44.45,67.94 43.18,67.94 41.91,67.94 41.91,68.58
  Bottom 2.54: IN2.1 40.01,55.88 41.91,57.78 41.91,67.94 | 41.91,68.58 R3.1
N$4
  Bottom 0.61: IC2.4 46.04,72.7 44.45,74.3 41.97,74.3 R3.2
  Bottom 2.54: SERVO_2.2 R3.2
N$5
  Bottom 0.406: C14.1 67.31,67.94
  Bottom 0.61: IC3.5 70.8,71.44 69.85,70.48 69.22,70.48 68.9,70.17 IC3.3 68.9,68.9 67.94,67.94 67.31,67.94 66.04,67.94 64.77,67.94 R5.1
  Bottom 2.54: IN3.1 62.87,55.88 64.77,57.78 64.77,67.94
N$6
  Bottom 0.61: IC3.4 68.9,72.7 67.31,74.3 64.77,74.3 R5.2
  Bottom 2.54: SERVO_3.2 64.77,74.3 R5.2
N$7
  Bottom 0.406: C15.1 90.17,67.94
  Bottom 0.61: IC4.5 93.66,71.44 92.71,70.48 92.07,70.48 91.76,70.17 IC4.3 91.76,68.9 90.8,67.94 90.17,67.94 88.9,67.94 88.32,67.94 R7.1 87.63,68.58
  Bottom 2.54: IN4.1 85.72,53.34 87.63,55.24 87.63,68.58
N$8
  Bottom 0.61: IC4.4 91.76,72.7 90.17,74.3 87.63,74.3 R7.2
  Bottom 2.54: SERVO_4.2 87.63,74.3 R7.2
N$9
  Bottom 0.406: C16.1 113.03,67.94
  Bottom 0.61: IC5.5 116.52,71.44 115.57,70.48 114.93,70.48 114.62,70.17 IC5.3 114.62,68.9 113.66,67.94 113.03,67.94 111.76,67.94 110.49,67.94 | 110.49,68.58 R9.1
  Bottom 2.54: IN5.1 108.58,55.88 110.49,57.78 110.49,67.94 110.49,68.58
N$10
  Bottom 0.61: IC5.4 114.62,72.7 113.03,74.3 110.49,74.3 R9.2
  Bottom 2.54: SERVO_5.2 110.49,74.3 R9.2
N$11
  Bottom 0.406: C17.1 135.89,67.94
  Bottom 0.61: IC6.5 139.38,71.44 138.43,70.48 137.8,70.48 137.48,70.17 IC6.3 137.48,68.9 136.53,67.94 135.89,67.94 134.62,67.94 133.99,68.58 133.35,68.58 R11.1
  Bottom 2.54: IN6.1 131.44,55.88 133.35,57.78 133.35,68.58
N$12
  Bottom 0.61: IC6.4 137.48,72.7 135.89,74.3 133.41,74.3 R11.2
  Bottom 2.54: SERVO_6.2 R11.2
N$14  (via drill 0.85 pad 1.42)
  Top 0.406: IC7.14 78.11,64.14 77.47,63.5 70.48,63.5 69.22,64.77 69.22,74.3 69.85,74.93 71.75,74.93 73.02,76.2 v73.02,76.84 | v73.02,83.19 73.02,83.82 74.93,85.72 75.56,86.36 165.74,86.36 v166.05,86.04
  Bottom 0.406: v73.02,76.84 v73.02,83.19 | U$1.6 168.28,75.56 165.74,78.11 165.74,85.41 v166.05,86.04
N$15  (via drill 0.85 pad 1.42)
  Top 0.406: IC7.15 79.38,63.5 78.11,62.23 69.85,62.23 67.94,64.14 67.94,74.93 69.85,76.84 v71.12,76.84 | 74.93,87.63 74.61,87.31 | 74.61,87.31 71.12,83.82 v71.12,83.19 | v168.28,87.63 166.05,87.63 74.93,87.63 | 74.93,87.63 74.61,87.31
  Bottom 0.406: v71.12,83.19 v71.12,76.84 | U$1.7 168.91,78.11 168.28,78.74 v168.28,87.63
N$29
  Bottom 1.422: U$4.P$3 11.21,47.84 8.85,50.2 X11.2
NOTAUS  (via drill 0.85 pad 1.42)
  Top 0.305: v157.8,31.11 157.48,31.43 157.48,52.7 158.75,53.98 158.75,60.33 159.39,60.96 v159.39,72.39
  Top 0.61: D2.C D1.C
  Bottom 0.305: U$11.P$20 160.65,26.67 160.02,26.67 158.44,26.67 158.43,26.67 | 140.97,1.91 141.29,1.91 157.16,1.91 159.39,4.13 159.39,7.94 156.21,11.11 156.21,19.68 157.16,20.64 158.43,21.91 158.43,26.67 | v157.8,31.11 158.43,30.48 158.43,26.67 | v159.39,72.39 159.39,80.33 158.43,81.28 156.84,81.28 U$1.10
  Bottom 0.406: 140.97,1.91 16.83,1.91 13.97,4.76 13.97,8.89 12.07,10.8 7.62,10.8 3.81,14.6 3.81,24.13 | 3.81,24.13 3.81,24.45 3.81,28.74 U$4.P$2 | D1.C 3.81,24.13
OUT1  (via drill 0.85 pad 1.42)
  Top 0.406: IC7.3 78.11,78.74 76.83,80.01 52.71,80.01 29.84,80.01 v26.67,83.19
  Bottom 0.406: v26.67,83.19 21.59,83.19 SERVO_1.3
OUT2  (via drill 0.85 pad 1.42)
  Top 0.406: IC7.2 79.38,79.38 77.47,81.28 52.71,81.28 v50.8,83.19
  Bottom 0.406: v50.8,83.19 44.58,83.19 SERVO_2.3
OUT3  (via drill 0.85 pad 1.42)
  Top 0.406: IC7.4 76.83,78.11 76.2,78.74 69.22,78.74 v68.58,78.11
  Bottom 0.406: SERVO_3.3 67.31,83.19 67.31,79.38 v68.58,78.11
OUT4  (via drill 0.85 pad 1.42)
  Top 0.406: IC7.7 73.02,70.48 73.66,69.85 81.28,69.85 81.91,70.48 81.91,79.38 83.18,80.64 93.34,80.64 v95.88,83.19
  Bottom 0.406: 90.3,83.19 SERVO_4.3 90.3,83.19 | v95.88,83.19 90.3,83.19
OUT5  (via drill 0.85 pad 1.42)
  Top 0.406: IC7.10 73.02,67.94 73.66,68.58 81.91,68.58 83.18,69.85 83.18,78.74 83.82,79.38 93.98,79.38 95.88,81.28 116.2,81.28 v118.11,83.19
  Bottom 0.406: v118.11,83.19 113.16,83.19 SERVO_5.3
OUT6  (via drill 0.85 pad 1.42)
  Top 0.406: IC7.1 80.64,83.82 81.91,85.09 v127,85.09
  Bottom 0.406: SERVO_6.3 135.89,84.45 135.25,85.09 v127,85.09
P_OUT1  (via drill 0.85 pad 1.42)
  Top 0.406: IC8.1 96.52,65.41 96.52,64.14 93.98,61.59 92.71,62.86 v91.44,62.86 89.53,60.96 26.67,60.96 v25.4,59.69
  Bottom 0.406: v91.44,62.86 92.71,62.86 93.34,62.23 93.98,61.59 JP1.6
  Bottom 0.61: IC1.1 25.08,66.78 R2.2 C6.1 24.98,60.11 v25.4,59.69
P_OUT2  (via drill 0.85 pad 1.42)
  Top 0.406: IC8.2 97.79,64.77 97.79,63.5 96.52,62.23 JP1.5 96.52,60.33 95.88,59.69 92.07,59.69 v91.44,60.33 90.8,59.69 90.17,59.69 49.53,59.69 v48.26,58.42
  Bottom 0.406: v91.44,60.33 92.07,59.69 95.88,59.69 96.52,60.33 JP1.5
  Bottom 0.61: IC2.1 47.94,66.78 R4.2 C7.1 47.84,58.84 v48.26,58.42
P_OUT3  (via drill 0.85 pad 1.42)
  Top 0.406: IC8.3 99.06,61.59 JP1.4 | v71.12,57.78 71.75,58.42 93.34,58.42 96.27,58.42 98.42,58.42 v99.06,59.05 | v99.06,59.05 99.06,59.69 | 99.06,59.69 99.06,60.96 | 99.06,59.69 v99.06,59.05
  Bottom 0.406: v99.06,59.05 JP1.4
  Bottom 0.61: IC3.1 70.8,66.78 R6.2 C8.1 70.7,58.2 v71.12,57.78
P_OUT4  (via drill 0.85 pad 1.42)
  Top 0.406: IC8.4 100.33,63.5 101.6,62.23 v101.6,59.05
  Bottom 0.406: v101.6,59.05 JP1.3
  Bottom 0.61: IC4.1 93.66,66.78 R8.2 C9.1 93.56,64.56 94.61,63.5 100.33,63.5 101.6,62.23 JP1.3
P_OUT5  (via drill 0.85 pad 1.42)
  Top 0.406: IC8.5 101.6,64.14 104.14,61.59 v104.14,59.05 104.77,58.42 114.3,58.42 v116.2,60.33
  Bottom 0.406: v116.2,60.33 116.2,60.96 | 116.2,66.46 R10.2 | v104.14,59.05 JP1.2
  Bottom 0.61: IC5.1 116.52,66.78 R10.2 | C10.1 116.2,64.98 116.2,66.46 116.2,60.96 v116.2,60.33
P_OUT6  (via drill 0.85 pad 1.42)
  Top 0.406: IC8.6 102.87,64.77 104.14,63.5 v105.41,63.5 106.05,64.14 136.53,64.14 v139.06,61.59
  Bottom 0.406: 139.06,66.46 R12.2 | v105.41,63.5 106.68,62.23 JP1.1
  Bottom 0.61: IC6.1 139.38,66.78 R12.2 | 139.06,66.46 139.06,64.98 C11.1 139.06,64.56 v139.06,61.59
RESET
  Bottom 0.406: U$1.RST2 159.39,60.33 160.66,59.05 160.66,53.66 159.39,52.39 159.39,35.56 160.97,33.97 160.97,31.11 161.61,30.48 161.93,30.48 U$11.P$22
SCK  (via drill 0.8 pad 1.42, 0.85 pad 1.42)
  Top 0.305: v176.85,10.48 177.8,11.43 177.8,45.09 175.26,47.62 170.18,47.62 167.64,50.16 167.64,72.07 165.42,74.3 v157.48,74.3
  Top 0.406: IC8.13 100.33,69.85 101.6,68.58 107.31,68.58 110.49,65.41 v120.65,65.41 | v120.65,65.41 120.97,65.41 | 120.97,65.41 133.35,65.41 135.25,67.31 136.53,68.58 137.8,69.85 150.5,69.85 152.4,71.75 152.4,74.3 153.67,75.56 156.21,75.56 v157.48,74.3 | v120.65,65.41 120.97,65.41
  Bottom 0.305: U1.1 177.17,10.8 v176.85,10.48
  Bottom 0.406: v157.48,74.3 156.21,75.56 U$1.13 | JP2.1 120.84,65.6 v120.65,65.41
SCK+  (via drill 0.8 pad 1.42)
  Top 0.305: v174.62,10.48 173.04,8.89 171.77,8.89 170.81,9.84 170.81,11.11 171.77,12.06 172.4,12.06 173.04,12.7 175.9,15.56 175.9,31.43 174.94,32.38 U$11.P$7
  Bottom 0.305: U1.2 175.9,11.75 v174.62,10.48
SCK-  (via drill 0.8 pad 1.42)
  Top 0.305: v172.4,10.48 176.85,14.92 176.85,32.07 175.58,33.34 167.32,33.34 U$11.P$8
  Bottom 0.305: U1.3 174.62,12.38 173.99,11.75 173.67,11.75 v172.4,10.48

### Text on the board
Top: CS_MCP | MOSI | MISO | GND | SCK | TFT | Kran Power V1.3 | CS | DC | 05.05.2014 | GND | VCC | +12V | GND
tNames: 1 2 3 4 5 6 | Servo Analog
tTest: cutout
tRestrict: . | .
bRestrict: .